# EAGLE design Anand1-TOP_New (EAGLE 9.5.2)
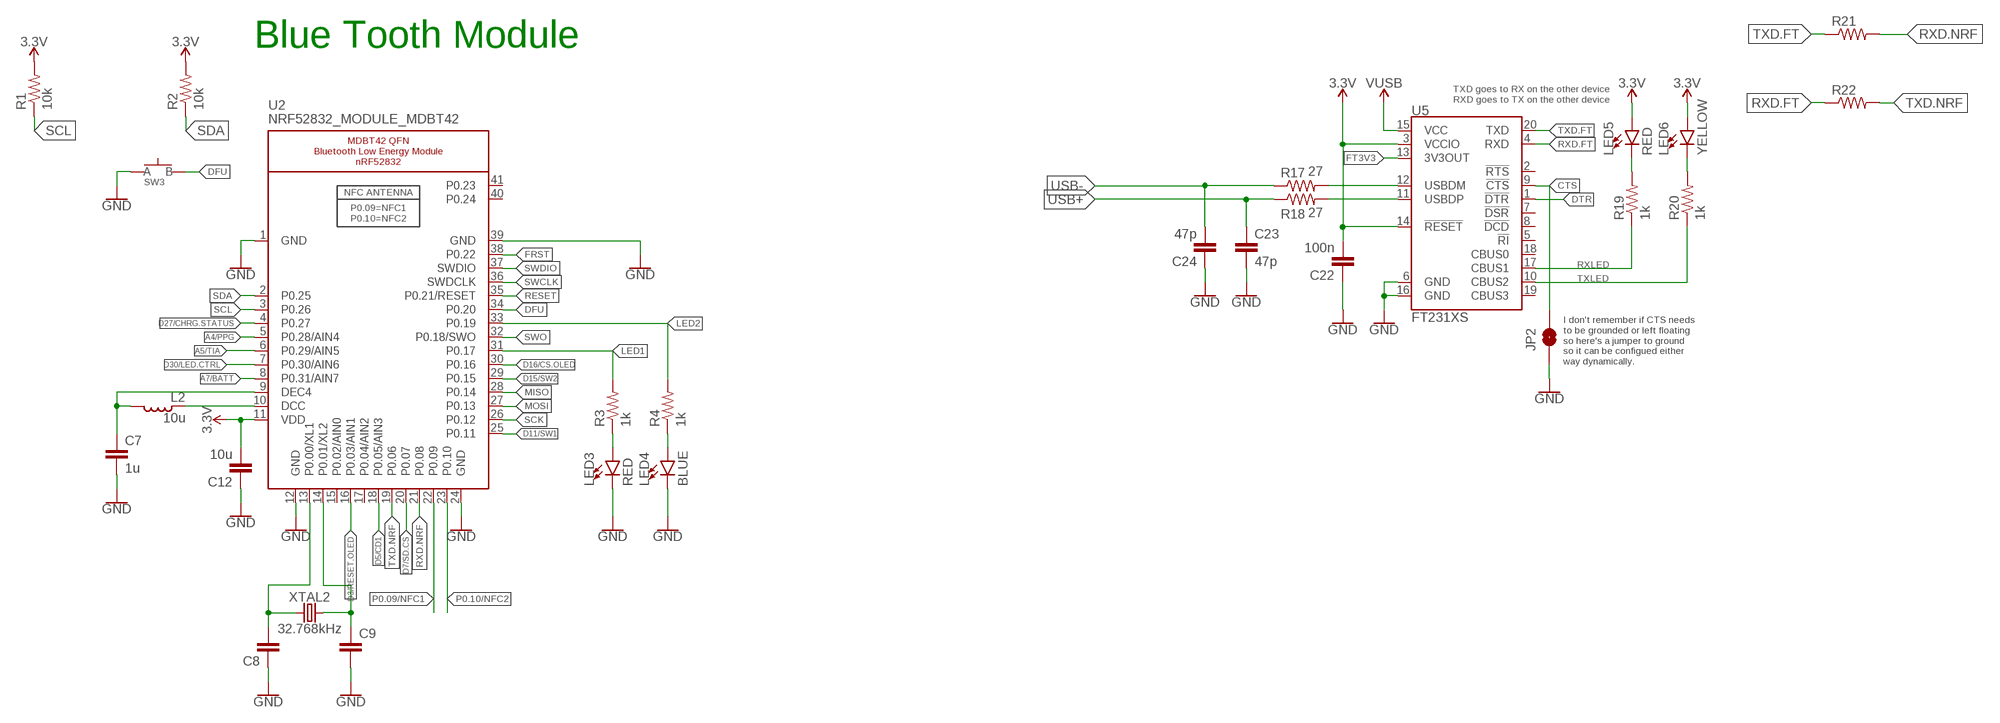
[diagram p0: schematic, sheet 1, part 1 of 3]
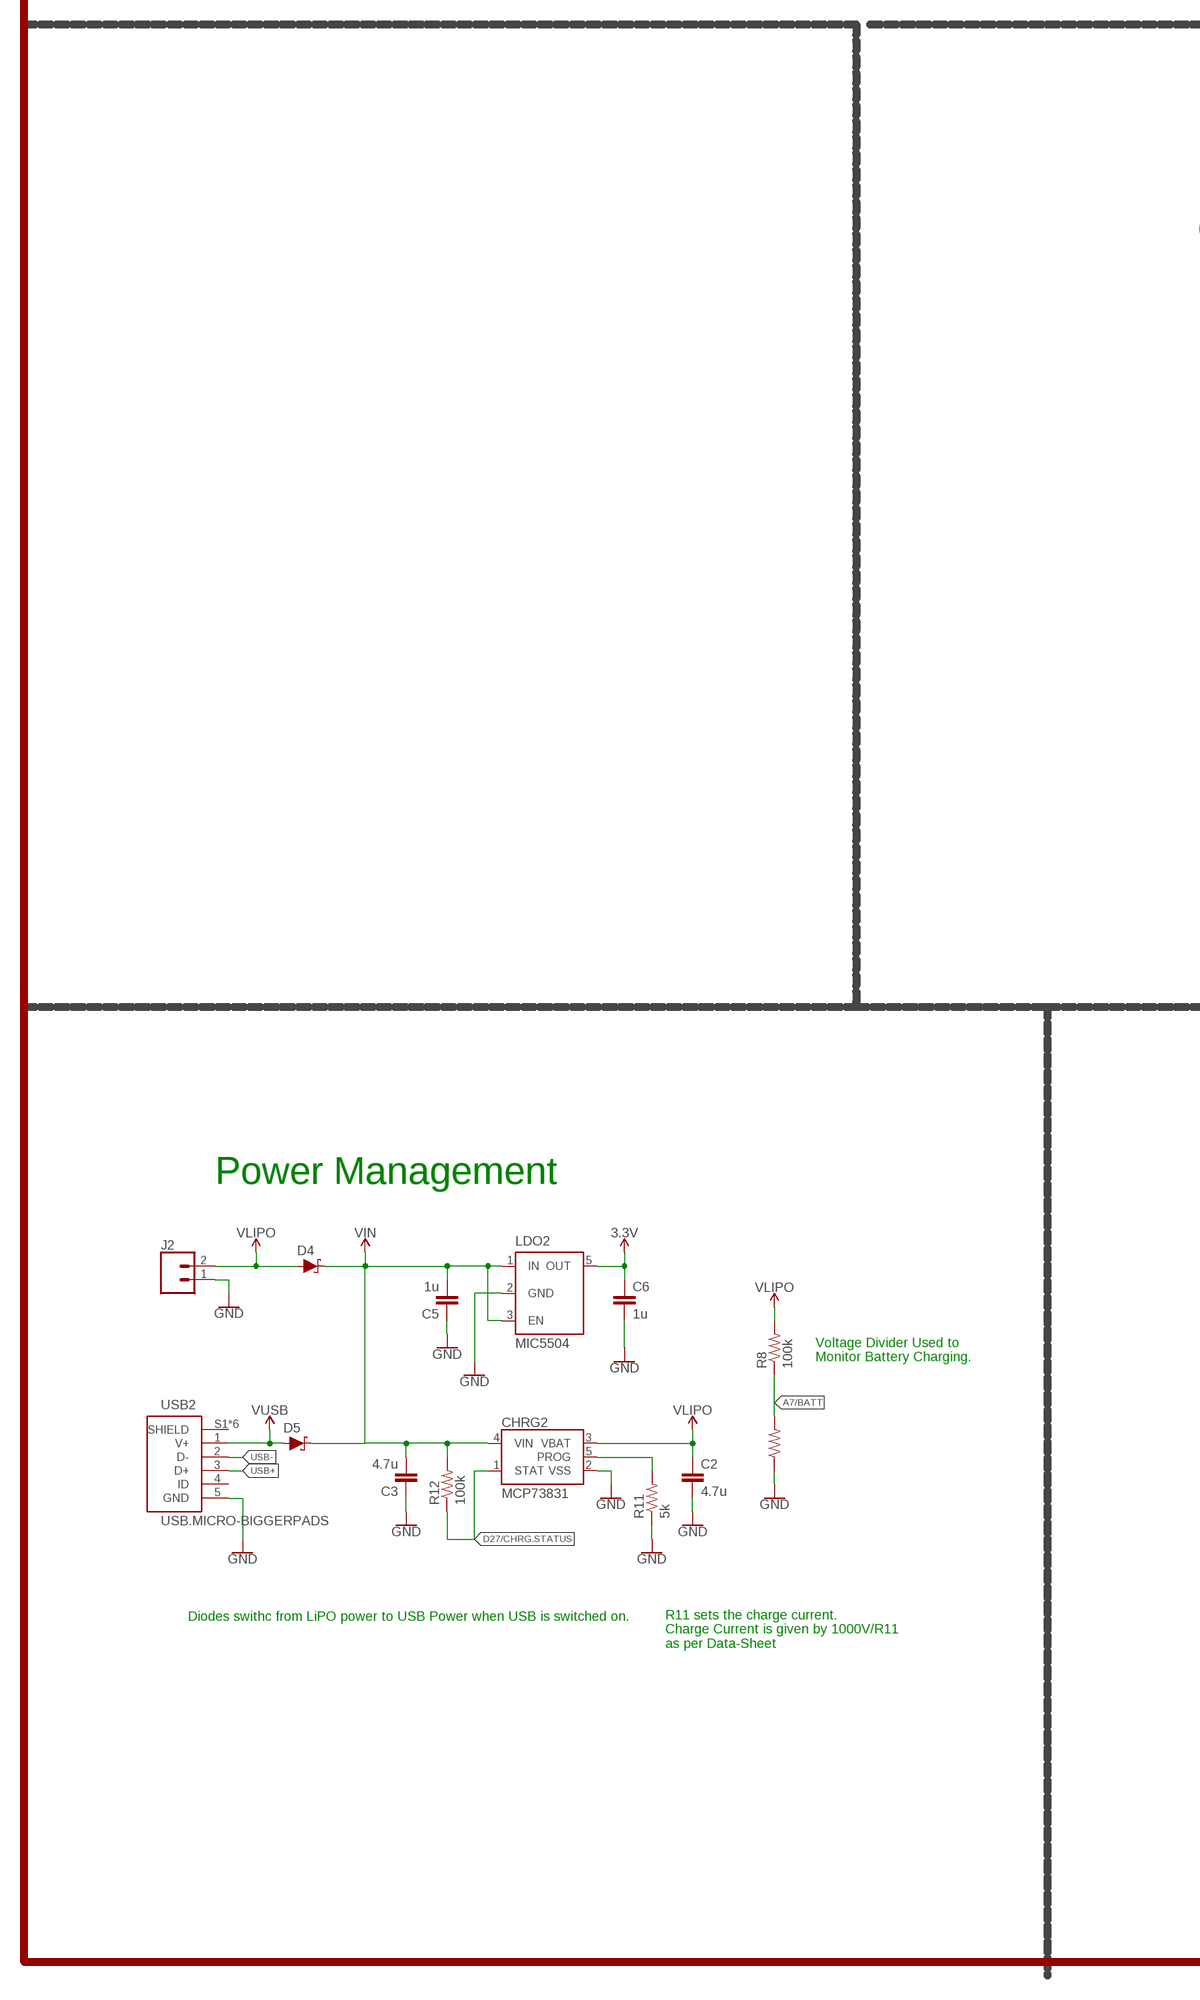
[diagram p1: schematic, sheet 1, part 2 of 3]
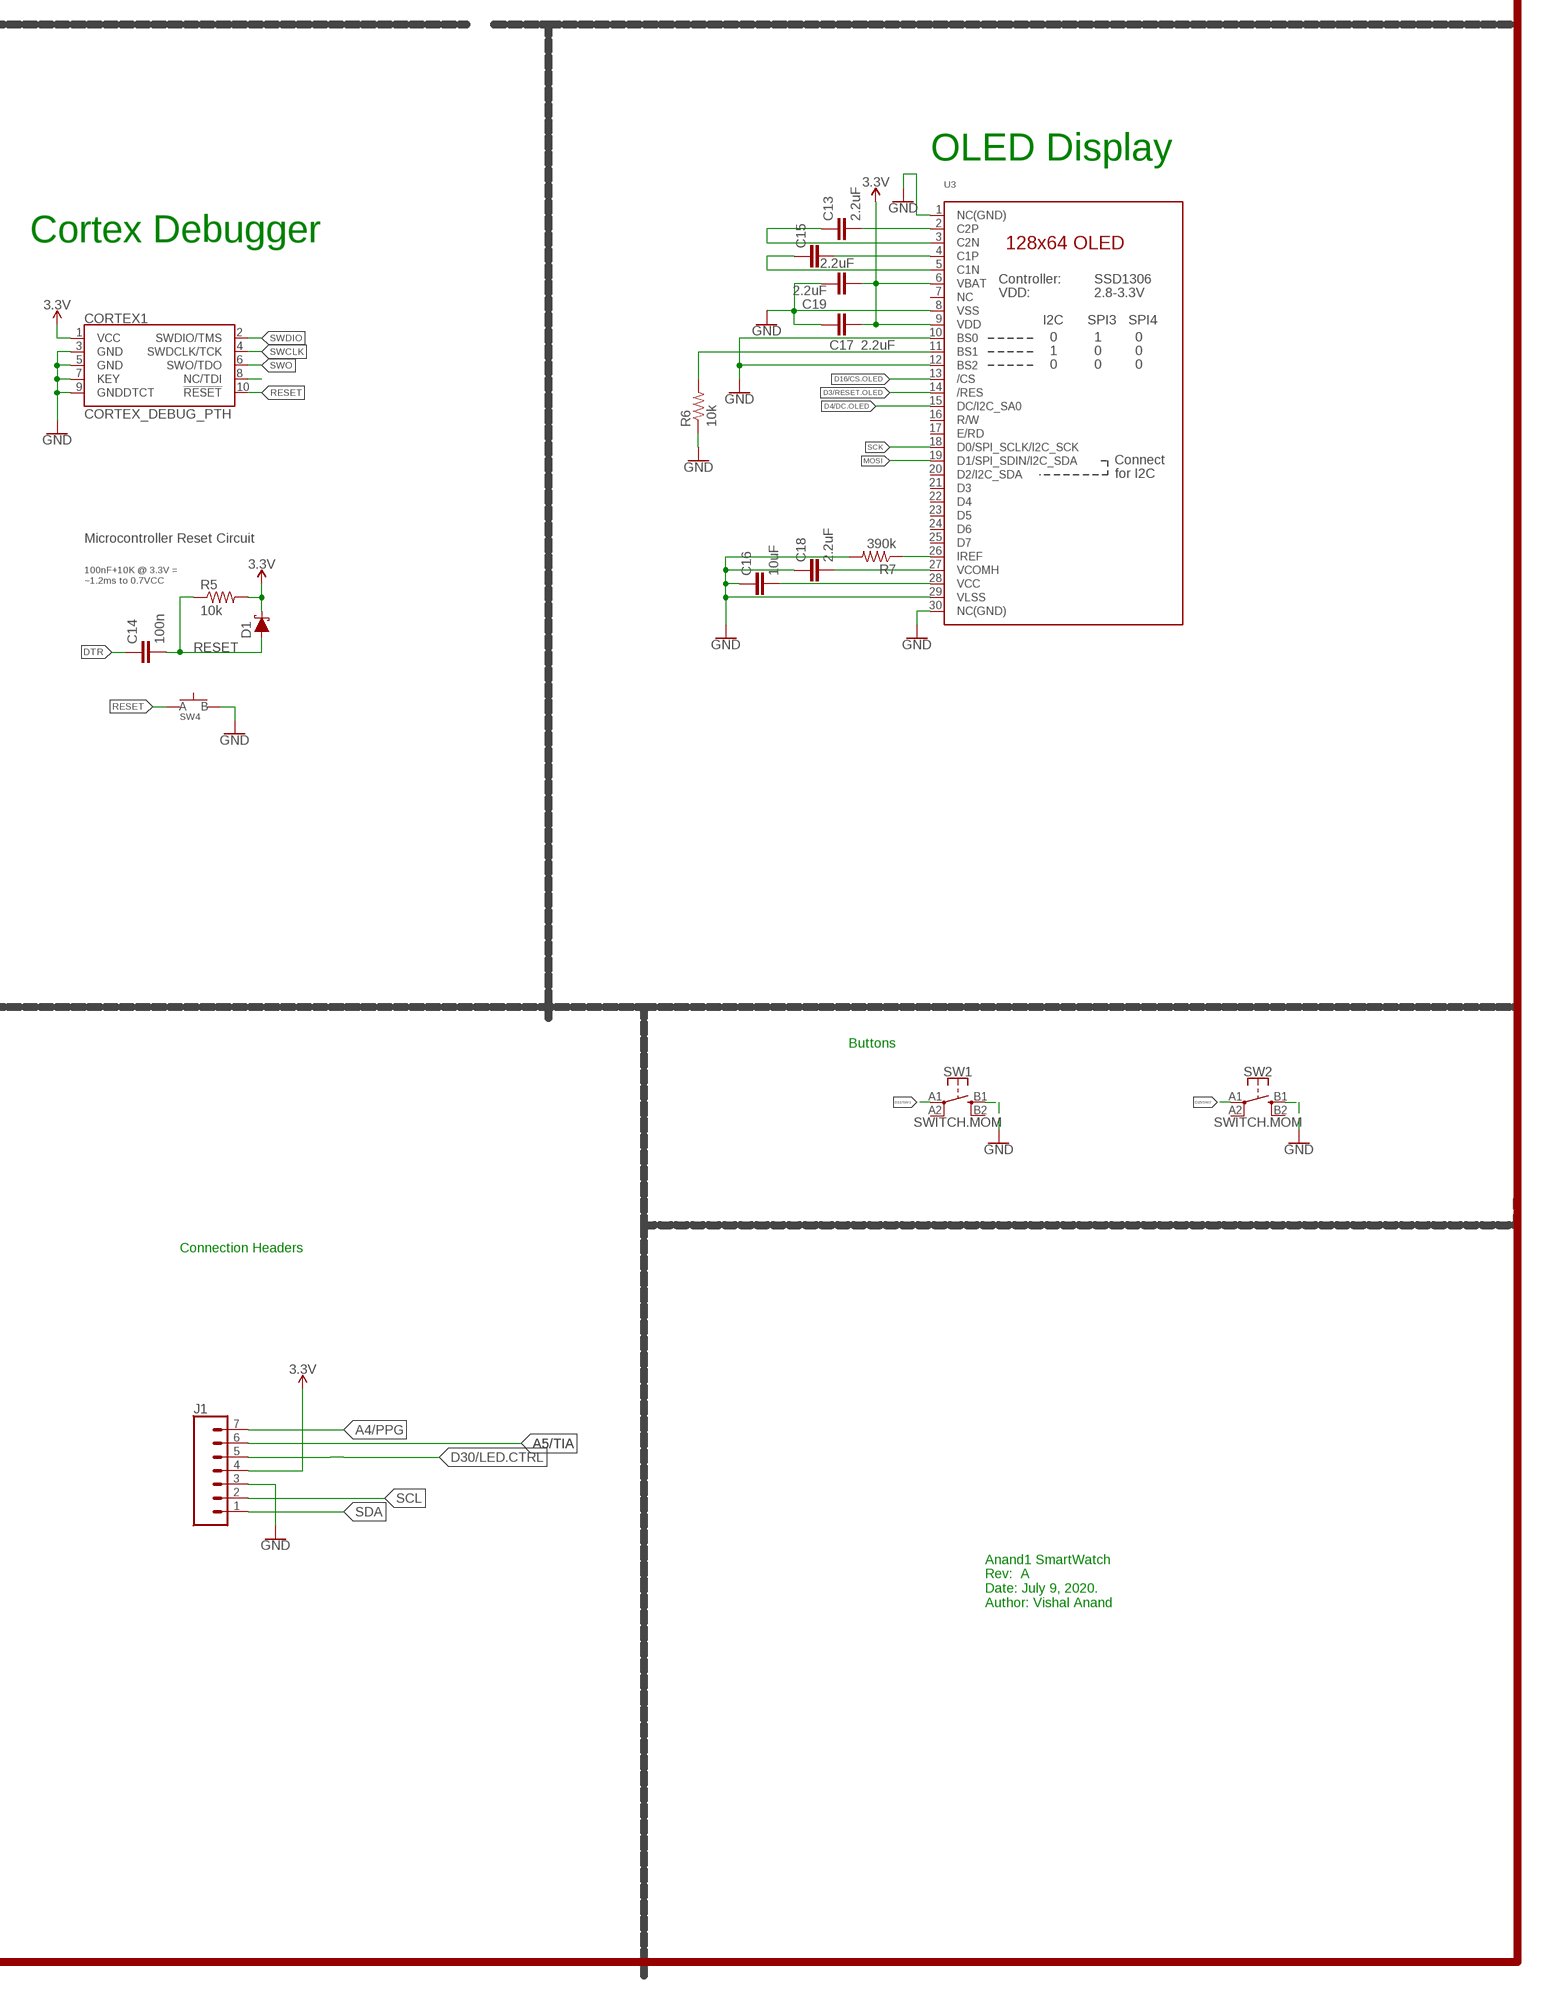
[diagram p2: schematic, sheet 1, part 3 of 3]

## Parts
C2  4.7u  CAPACITOR0603  [C0603]
C3  4.7u  CAPACITOR0603  [C0603]
C5  1u  CAPACITOR0603  [C0603]
C6  1u  CAPACITOR0603  [C0603]
C7  1u  CAPACITOR0603  [C0603]
C8  CAPACITOR0603  [C0603]
C9  CAPACITOR0603  [C0603]
C12  10u  CAPACITOR0805  [C0805]
C13  2.2uF  CAPACITOR0402  [C0402]
C14  100n  CAPACITOR0603  [C0603]
C15  2.2uF  CAPACITOR0402  [C0402]
C16  10uF  CAPACITOR0603  [C0603]
C17  2.2uF  CAPACITOR0402  [C0402]
C18  2.2uF  CAPACITOR0402  [C0402]
C19  2.2uF  CAPACITOR0402  [C0402]
C22  100n  CAPACITOR0603  [C0603]
C23  47p  CAPACITOR0603  [C0603]
C24  47p  CAPACITOR0603  [C0603]
CHRG2  MCP73831  [SOT23-5]
CORTEX1  CORTEX_DEBUG_PTH  [2X5-PTH-1.27MM]
D1  SCHOTTKY-USC  [USC]
D4  SCHOTTKY-USC  [USC]
D5  SCHOTTKY-USC  [USC]
J1  CONN_07-1.27MM  [1X07_1.27MM]
J2  CONN_02  [1X02]
JP2  JUMPER-SMT_2_NO_SILK  [SMT-JUMPER_2_NO_SILK]
L2  10u  INDUCTOR0603  [L0603]
LDO2  MIC5504  [SOT23-5]
LED3  RED  LED0603  [LED-0603]
LED4  BLUE  LED0603  [LED-0603]
LED5  RED  LED0603  [LED-0603]
LED6  YELLOW  LED0603  [LED-0603]
R1  10k  RESISTOR0603  [R0603]
R2  10k  RESISTOR0603  [R0603]
R3  1k  RESISTOR0603  [R0603]
R4  1k  RESISTOR0603  [R0603]
R5  10k  RESISTOR0603  [R0603]
R6  10k  RESISTOR0603  [R0603]
R7  390k  RESISTOR0603  [R0603]
R8  100k  RESISTOR0603  [R0603]
R9  100k  RESISTOR0603  [R0603]
R11  5k  RESISTOR0603  [R0603]
R12  100k  RESISTOR0603  [R0603]
R17  27  RESISTOR0603  [R0603]
R18  27  RESISTOR0603  [R0603]
R19  1k  RESISTOR0603  [R0603]
R20  1k  RESISTOR0603  [R0603]
R21  RESISTOR0603  [R0603]
R22  RESISTOR0603  [R0603]
SW1  SWITCH.MOM  [TACTILE_SWITCH_SMD_6.2MM_TALL]
SW2  SWITCH.MOM  [TACTILE_SWITCH_SMD_6.2MM_TALL]
SW3  SPST-PTS830GG140-COPY.1-3  [BUTTON-GULLWING]
SW4  SPST-PTS830GG140-COPY.1-3  [BUTTON-GULLWING]
U2  NRF52832_MODULE_MDBT42  [BLE_MODULE_RAYTAC_MDBT42]
U3  DISP_OLED_UG-2864HSWEG01-NO-WRAPAROUND  [UG-2864HSWEG01_0.96IN_NO-WRAPAROUND]
U5  FT231XS  [SSOP20_L]
USB2  USB.MICRO-BIGGERPADS  [USB-MICRO-01.BIGGERPADS]
XTAL2  32.768kHz  CRYSTALECS-.327-12.5-12-C-TR  [2-SMD.NOLEAD.2.0MMTO1.2MM]

## Nets
3.3V: C6.1 C12.2 C17.2 C19.2 C22.2 CORTEX1.1(VCC) D1.-(C) J1.4 LDO2.5(OUT) LED5.A LED6.A R1.2 R2.2 R5.2 U2.11(VDD) U3.6(VBAT) U3.9(VDD) U5.3(VCCIO) U5.14(!RESET)
A4/PPG: J1.7 U2.5(P0.28/AIN4)
A5/TIA: J1.6 U2.6(P0.29/AIN5)
A7/BATT: R8.1 R9.2 U2.8(P0.31/AIN7)
CTS: JP2.2 U5.9(!CTS)
D3/RESET.OLED: U2.16(P0.03/AIN1) U3.14(/RES)
D4/DC.OLED: U3.15(DC/I2C_SA0)
D5/CD1: U2.18(P0.05/AIN3)
D7/SD.CS: U2.20(P0.07)
D11/SW1: SW1.A1 U2.25(P0.11)
D15/SW2: SW2.A1 U2.29(P0.15)
D16/CS.OLED: U2.30(P0.16) U3.13(/CS)
D27/CHRG.STATUS: CHRG2.1(STAT) R12.1 U2.4(P0.27)
D30/LED.CTRL: J1.5 U2.7(P0.30/AIN6)
DFU: SW3.3(B) U2.34(P0.20)
DTR: C14.1 U5.1(!DTR)
FRST: U2.38(P0.22)
FT3V3: U5.13(3V3OUT)
GND: C2.2 C3.1 C5.1 C6.2 C7.2 C8.1 C9.2 C12.1 C16.1 C17.1 C18.1 C19.1 C22.1 C23.2 C24.1 CHRG2.2(VSS) CORTEX1.3(GND) CORTEX1.5(GND) CORTEX1.7(KEY) CORTEX1.9(GNDDTCT) J1.3 J2.1 JP2.1 LDO2.2(GND) LED3.C LED4.C R6.1 R7.2 R9.1 R11.1 SW1.B1 SW2.B1 SW3.1(A) SW4.3(B) U2.1(GND) U2.12(GND) U2.24(GND) U2.39(GND) U3.1(NC(GND)) U3.8(VSS) U3.10(BS0) U3.12(BS2) U3.29(VLSS) U3.30(NC(GND)) U5.6(GND) U5.16(GND) USB2.5(GND)
LED1: R3.2 U2.31(P0.17)
LED2: R4.2 U2.33(P0.19)
MISO: U2.28(P0.14)
MOSI: U2.27(P0.13) U3.19(D1/SPI_SDIN/I2C_SDA)
N$1: R6.2 U3.11(BS1)
N$2: R7.1 U3.26(IREF)
N$3: C13.2 U3.2(C2P)
N$4: C8.2 U2.13(P0.00/XL1) XTAL2.P$1
N$5: C13.1 U3.3(C2N)
N$6: C9.1 U2.14(P0.01/XL2) XTAL2.P$2
N$7: C15.2 U3.4(C1P)
N$8: C15.1 U3.5(C1N)
N$9: LED3.A R3.1
N$10: LED4.A R4.1
N$11: L2.1 U2.10(DCC)
N$12: C7.1 L2.2 U2.9(DEC4)
N$13: C16.2 U3.28(VCC)
N$14: CORTEX1.8(NC/TDI)
N$15: C18.2 U3.27(VCOMH)
N$16: CHRG2.5(PROG) R11.2
N$23: R17.2 U5.12(USBDM)
N$24: R18.2 U5.11(USBDP)
N$25: LED5.C R19.2
N$26: LED6.C R20.2
P0.09/NFC1: U2.22(P0.09)
P0.10/NFC2: U2.23(P0.10)
RESET: C14.2 CORTEX1.10(!RESET) D1.+(A) R5.1 SW4.1(A) U2.35(P0.21/RESET)
RXD.FT: R22.1 U5.4(RXD)
RXD.NRF: R21.2 U2.21(P0.08)
RXLED: R19.1 U5.17(CBUS1)
SCK: U2.26(P0.12) U3.18(D0/SPI_SCLK/I2C_SCK)
SCL: J1.2 R1.1 U2.3(P0.26)
SDA: J1.1 R2.1 U2.2(P0.25)
SWCLK: CORTEX1.4(SWDCLK/TCK) U2.36(SWDCLK)
SWDIO: CORTEX1.2(SWDIO/TMS) U2.37(SWDIO)
SWO: CORTEX1.6(SWO/TDO) U2.32(P0.18/SWO)
TXD.FT: R21.1 U5.20(TXD)
TXD.NRF: R22.2 U2.19(P0.06)
TXLED: R20.1 U5.10(CBUS2)
USB+: C23.1 R18.1 USB2.3(D+)
USB-: C24.2 R17.1 USB2.2(D-)
V_USB: D5.+(A) U5.15(VCC) USB2.1(V+) ; supply symbol labelled VUSB
VIN1: C3.2 C5.2 CHRG2.4(VIN) D4.-(C) D5.-(C) LDO2.1(IN) LDO2.3(EN) R12.2 ; supply symbol labelled VIN
VLIPO: C2.1 CHRG2.3(VBAT) D4.+(A) J2.2 R8.2
Unconnected: SW1.A2 SW1.B2 SW2.A2 SW2.B2 U2.15(P0.02/AIN0) U2.17(P0.04/AIN2) U2.40(P0.24) U2.41(P0.23) U3.7(NC) U3.16(R/W) U3.17(E/RD) U3.20(D2/I2C_SDA) U3.21(D3) U3.22(D4) U3.23(D5) U3.24(D6) U3.25(D7) U5.2(!RTS) U5.5(!RI) U5.7(!DSR) U5.8(!DCD) U5.18(CBUS0) U5.19(CBUS3) USB2.4(ID) USB2.S1(SHIELD) USB2.S2(SHIELD) USB2.S3(SHIELD) USB2.S4(SHIELD) USB2.S5(SHIELD) USB2.S6(SHIELD)

## Notes on the sheet
- Blue Tooth Module
- TXD goes to RX on the other device
  RXD goes to TX on the other device
- I don't remember if CTS needs
  to be grounded or left floating
  so here's a jumper to ground
  so it can be configued either
  way dynamically.
- OLED Display
- Cortex Debugger
- Microcontroller Reset Circuit
- 100nF+10K @ 3.3V =
  ~1.2ms to 0.7VCC
- Buttons
- Power Management
- Connection Headers
- Voltage Divider Used to 
  Monitor Battery Charging.
- Anand1 SmartWatch
  Rev:  A
  Date: July 9, 2020.
  Author: Vishal Anand
- Diodes swithc from LiPO power to USB Power when USB is switched on.
- R11 sets the charge current. 
  Charge Current is given by 1000V/R11
  as per Data-Sheet

## Library data of the parts
C2 C3 C5-C9 C12-C19 C22-C24 = LinnesLab-Passives:CAPACITOR
CHRG2 = LinnesLab-Power:MCP73831: MCP73831T Li-Ion, Li-Pol Controller Miniature single cell, fully integrated Li-Ion, Li-polymer charge management controller Datasheet <http://ww1.microchip.com/downloads/en/DeviceDoc/20001984g.pdf> SparkFun Products: SparkFun ESP32 Thing <https://www.sparkfun.com/products/13907> SparkFun 9DoF Razor IMU M0 <https://www.sparkfun.com/products/14001>; PROD_ID: IC-09995
CORTEX1 = LinnesLab-Connectors:CORTEX_DEBUG: Cortex Debug Connector - 10 pin Supports JTAG debug, Serial Wire debug, and Serial Wire Viewer. PTH and SMD connector options available. General Connector Information <http://infocenter.arm.com/help/topic/com.arm.doc.faqs/attached/13634/cortex_debug_connectors.pdf> Products: PTH Connector <http://www.digikey.com/product-detail/en/cnc-tech/3220-10-0100-00/1175-1627-ND/3883661> -via Digi-Key SparkFun PSoc <https://www.sparkfun.com/products/13229> SparkFun T <https://www.sparkfun.com/products/13810>
D1 D4 D5 = LinnesLab-DiscreteSemi:SCHOTTKY: Schottky diode A Schottky diode is a semiconductor diode which has a low forward voltage drop and a very fast switching action. Example: Digi-Key Part Number: RB161MM-20CT-ND
J1 = LinnesLab-Connectors:CONN_07: Multi connection point. Often used as Generic Header-pin footprint for 0.1 inch spaced/style header connections On any of the 0.1 inch spaced packages, you can populate with these: Break Away Headers - Straight <https://www.sparkfun.com/products/116> (PRT-00116) Break Away Male Headers - Right Angle <https://www.sparkfun.com/products/553> (PRT-00553) Female Headers <https://www.sparkfun.com/products/115> (PRT-00115) Break Away Headers - Machine Pin <https://www.sparkfun.com/products/117> (PRT-00117) Break Away Female Headers - Swiss Machine Pin <https://www.sparkfun.com/products/743> (PRT-00743) For SCREWTERMINALS and SPRING TERMINALS visit here: Screw Terimnals on SparkFun.com <https://www.sparkfun.com/search/results?term=Screw+Terminals> (5mm/3.5mm/2.54mm spacing) This device is also useful as a general connection point to wire up your design to another part of your project. Our various solder wires solder well into these plated through hole pads. Hook-Up Wire - Assortment (Stranded, 22 AWG) <https://www.sparkfun.com/products/11375> (PRT-11375) Hook-Up Wire - Assortment (Solid Core, 22 AWG) <https://www.sparkfun.com/products/11367> (PRT-11367) View the entire wire category on our website here <https://www.sparkfun.com/categories/141> Special notes: Molex polarized connector foot print use with SKU : PRT-08231 with associated crimp pins and housings. 1MM SMD Version SKU: PRT-10208 NOTES ON THE VARIANTS LOCK and LOCK_LONGPADS... This footprint was designed to help hold the alignment of a through-hole component (i.e. 6-pin header) while soldering it into place. You may notice that each hole has been shifted either up or down by 0.005 of an inch from it's more standard position (which is a perfectly straight line). This slight alteration caused the pins (the squares in the middle) to touch the edges of the holes. Because they are alternating, it causes a "brace" to hold the component in place. 0.005 has proven to be the perfect amount of "off-center" position when using our standard breakaway headers. Although looks a little odd when you look at the bare footprint, once you have a header in there, the alteration is very hard to notice. Also,if you push a header all the way into place, it is covered up entirely on the bottom side.
J2 = LinnesLab-Connectors:CONN_02: Multi connection point. Often used as Generic Header-pin footprint for 0.1 inch spaced/style header connections On any of the 0.1 inch spaced packages, you can populate with these: Break Away Headers - Straight <https://www.sparkfun.com/products/116> (PRT-00116) Break Away Male Headers - Right Angle <https://www.sparkfun.com/products/553> (PRT-00553) Female Headers <https://www.sparkfun.com/products/115> (PRT-00115) Break Away Headers - Machine Pin <https://www.sparkfun.com/products/117> (PRT-00117) Break Away Female Headers - Swiss Machine Pin <https://www.sparkfun.com/products/743> (PRT-00743) For SCREWTERMINALS and SPRING TERMINALS visit here: Screw Terimnals on SparkFun.com <https://www.sparkfun.com/search/results?term=Screw+Terminals> (5mm/3.5mm/2.54mm spacing) This device is also useful as a general connection point to wire up your design to another part of your project. Our various solder wires solder well into these plated through hole pads. Hook-Up Wire - Assortment (Stranded, 22 AWG) <https://www.sparkfun.com/products/11375> (PRT-11375) Hook-Up Wire - Assortment (Solid Core, 22 AWG) <https://www.sparkfun.com/products/11367> (PRT-11367) View the entire wire category on our website here <https://www.sparkfun.com/categories/141> Special notes: Molex polarized connector foot print use with: PRT-08233 with associated crimp pins and housings. 2.54_SCREWTERM for use with PRT-10571. 3.5mm Screw Terminal footprints for PRT-08084 5mm Screw Terminal footprints for use with PRT-08432
JP2 = LinnesLab-Switches:JUMPER-SMT_2_NO: Normally open jumper This jumper has two pads in close proximity to each other. Apply solder to close the connection. Round pads are easier to solder for beginners, but are a lot larger. SparkFun Product that uses the round pads: SparkFun EL Sequencer <https://www.sparkfun.com/products/12781>
L2 = LinnesLab-Passives:INDUCTOR
LDO2 = LinnesLab-Power:MIC5504: MIC5504 Voltage Regulator Output Voltages: 1.0V to 3.3V Input Voltages: 2.5V to 5.5V Link to Datasheet http://ww1.microchip.com/downloads/en/DeviceDoc/MIC550X.pdf
LED3-LED6 = LinnesLab-LED:LED: LED (Generic) Standard schematic elements and footprints for 5mm, 3mm, 1206, and 0603 sized LEDs. Generic LEDs with no color specified. LTST-C190KGKT: arrow indicates cathode
R1-R9 R11 R12 R17-R22 = LinnesLab-Passives:RESISTOR
SW1 SW2 = LinnesLab-Switches:SWITCH.MOM: PTS645SM43SMTR92 LFS
SW3 SW4 = LinnesLab-Switches:SPST-PTS830GG140-COPY
U2 = LinnesLab-Microcontrollers:NRF52832_MODULE_MDBT42: MDBT42 - BLE Module (nRF52832 QFN) VDD: 1.7-3.6V
U3 = LinnesLab-Displays:DISP_OLED_UG-2864HSWEG01: UG-2864HSWEG01 OLED display Both 1.3" and 0.96" models share the same FPC tab footprint, only the screen dimensions vary.
U5 = LinnesLab-DigitalIC:FT231X: FTDI FT231X Full Speed USB to Full-handshake UART This USB2.0 Full Speed IC offers a compact bridge to full handshake UART interfaces. The device is a UART, capable of operating up to 3MBaud, with low power consumption (8mA). The FT231X includes the complete FT-X series feature set and enables USB to be added into a system design quickly and easily over a UART interface. Datasheet <http://cdn.sparkfun.com/datasheets/Components/General%20IC/DS_FT231X.pdf>; DIGIKEY: 768-1156-5-ND; MFN: FT231XS-U
USB2 = LinnesLab-Connectors:USB.MICRO: DigiKey PN: 609-4613-1-ND
XTAL2 = LinnesLab-Clocks:CRYSTAL

## Board
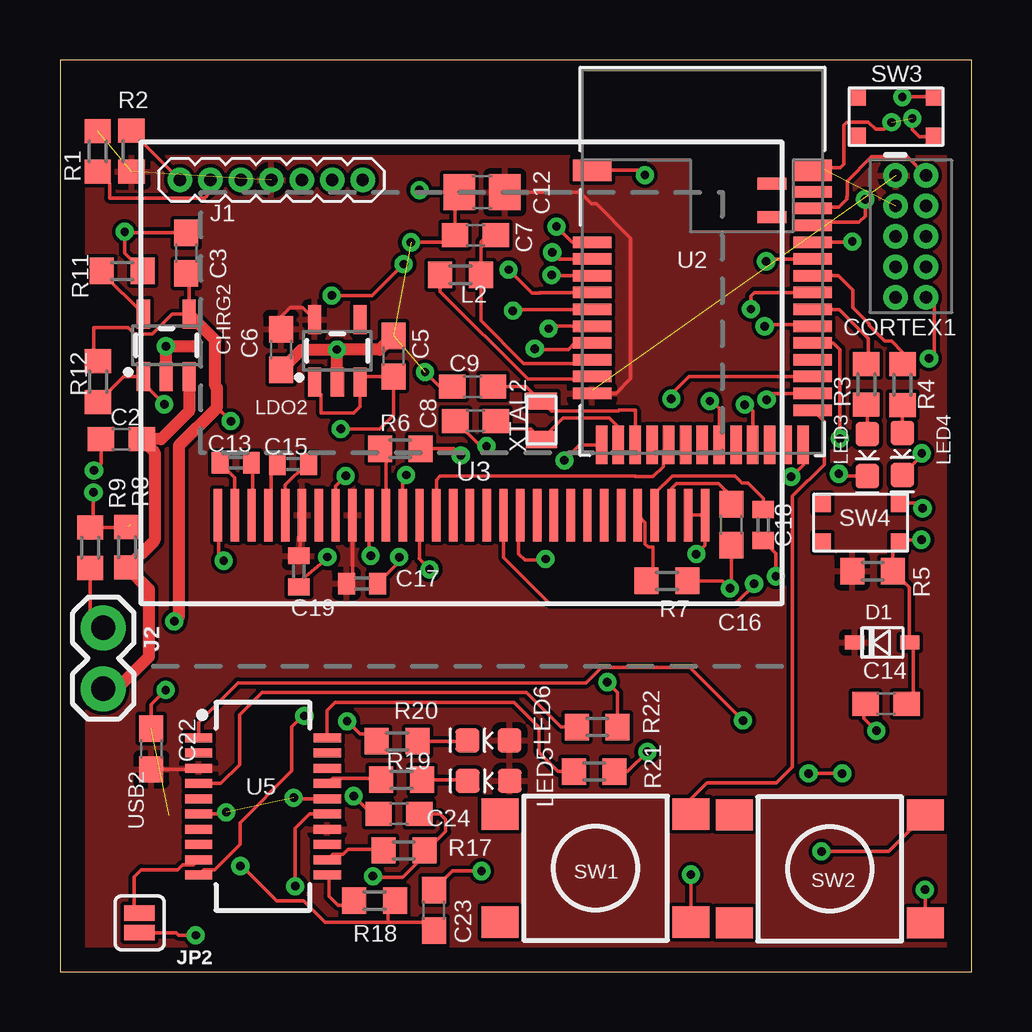
[diagram p3: board, top side]
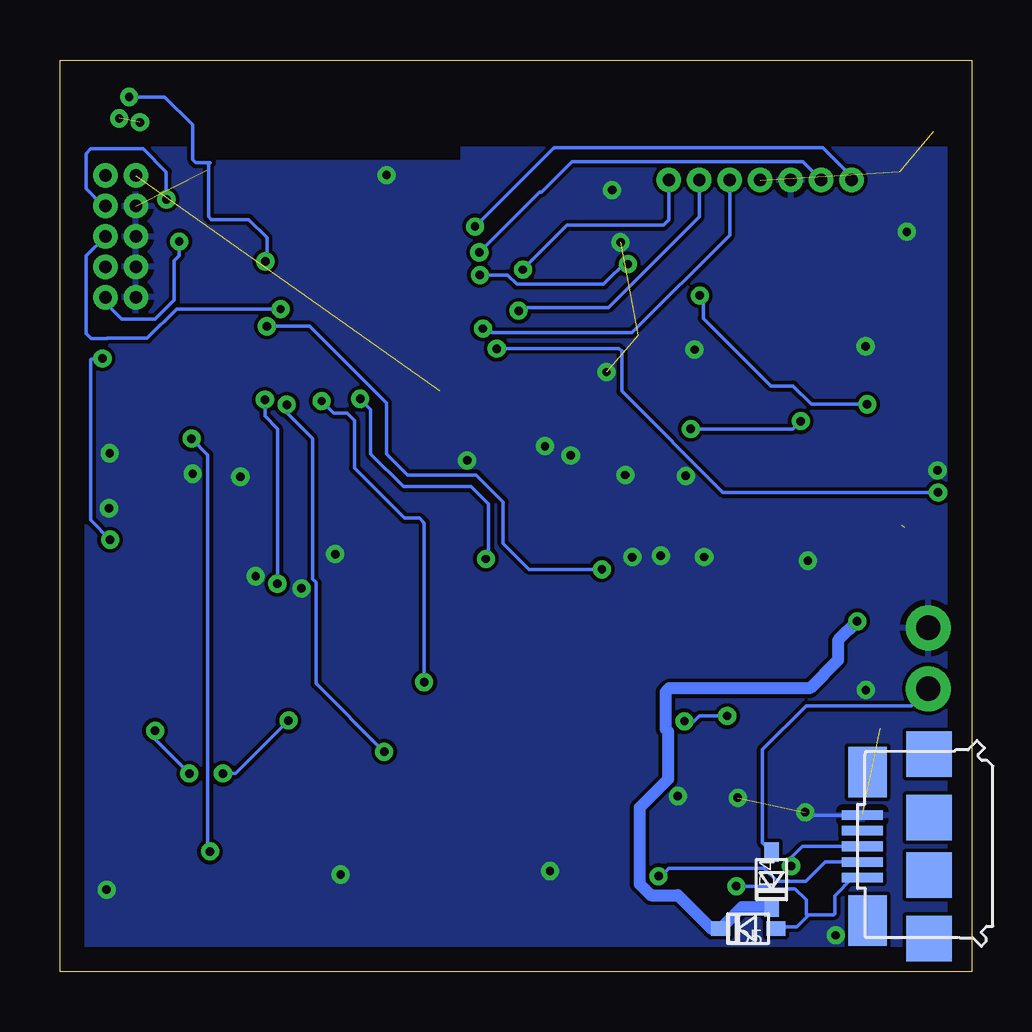
[diagram p4: board, bottom side, seen from below]

Size 38 x 38 mm. Coordinates in mm from the lower left corner, seen from the top.
Outline: 0,0 38,0 38,38 0,38 0,0
Copper layers (1*16): Top 0.035mm / dielectric 1.5mm / Bottom 0.035mm
Design rules "default": minimum track width 6mil, minimum drill 0.35mm, track to track 6mil, track to pad 6mil, pad to pad 6mil, via to via 6mil, smd to smd 6mil, copper to edge 40mil, drill to drill 6mil, minimum pad ring 10mil, minimum via ring 8mil, stop-mask expansion 4mil, vias tented up to drill 0mil, thermal gap 10mil

### Footprints (pad centres in the part's own frame; a part is rotated, then mirrored left to right if it is on the bottom)
C0603 = smd 1.1 x 1: 1 -0.85,0; 2 0.85,0
C0805 = smd 1.3 x 1.5: 1 -0.95,0; 2 0.95,0
C0402 = smd 0.7 x 0.9: 1 -0.65,0; 2 0.65,0
SOT23-5 = smd 0.55 x 1.2: 1 -0.95,-1.3; 2 0,-1.3; 3 0.95,-1.3; 4 0.95,1.3; 5 -0.95,1.3
2X5-PTH-1.27MM = drill 0.508 pad 1: 1 -2.54,-0.635; 2 -2.54,0.635; 3 -1.27,-0.635; 4 -1.27,0.635; 5 0,-0.635; 6 0,0.635; 7 1.27,-0.635; 8 1.27,0.635; 9 2.54,-0.635; 10 2.54,0.635
USC = smd 0.8 x 0.6: + -1.15,0; - 1.15,0
1X07_1.27MM = drill 0.508 pad 1: 1 0,0; 2 1.27,0; 3 2.54,0; 4 3.81,0; 5 5.08,0; 6 6.35,0; 7 7.62,0
1X02 = drill 1.016 pad 1.88: 1 0,0; 2 2.54,0
SMT-JUMPER_2_NO_SILK = smd 0.635 x 1.27: 1 -0.406,0; 2 0.406,0
L0603 = smd 1 x 1.1: 1 -0.85,0; 2 0.85,0
LED-0603 = smd 1 x 1: A -0.877,0; C 0.877,0
R0603 = smd 1 x 1.1: 1 -0.85,0; 2 0.85,0
TACTILE_SWITCH_SMD_6.2MM_TALL = smd 1.55 x 1.3: A1 -3.975,-2.25; A2 3.975,-2.25; B1 -3.975,2.25; B2 3.975,2.25
BUTTON-GULLWING = smd 0.7 x 0.75: 1 -1.6,0.825; 2 1.6,0.825; 3 -1.6,-0.825; 4 1.6,-0.825
BLE_MODULE_RAYTAC_MDBT42 = smd 1.6 x 0.9: 1 -4.6,3.8; 39 4.6,3.8 | smd 1.6 x 0.48: 2 -4.6,0.8; 3 -4.6,0.1; 4 -4.6,-0.6; 5 -4.6,-1.3; 6 -4.6,-2; 7 -4.6,-2.7; 8 -4.6,-3.4; 9 -4.6,-4.1; 10 -4.6,-4.8; 11 -4.6,-5.5; 25 4.6,-6.2; 26 4.6,-5.5; 27 4.6,-4.8; 28 4.6,-4.1; 29 4.6,-3.4; 30 4.6,-2.7; 31 4.6,-2; 32 4.6,-1.3; 33 4.6,-0.6; 34 4.6,0.1; 35 4.6,0.8; 36 4.6,1.5; 37 4.6,2.2; 38 4.6,2.9 | smd 0.48 x 1.6: 12 -4.2,-7.65; 13 -3.5,-7.65; 14 -2.8,-7.65; 15 -2.1,-7.65; 16 -1.4,-7.65; 17 -0.7,-7.65; 18 0,-7.65; 19 0.7,-7.65; 20 1.4,-7.65; 21 2.1,-7.65; 22 2.8,-7.65; 23 3.5,-7.65; 24 4.2,-7.65 | smd 1.2 x 0.5: 40 2.9,3.25; 41 2.9,1.85
UG-2864HSWEG01_0.96IN_NO-WRAPAROUND = smd 0.35 x 2.2: 1 -10.15,-1.2; 2 -9.45,-1.2; 3 -8.75,-1.2; 4 -8.05,-1.2; 5 -7.35,-1.2; 6 -6.65,-1.2; 7 -5.95,-1.2; 8 -5.25,-1.2; 9 -4.55,-1.2; 10 -3.85,-1.2; 11 -3.15,-1.2; 12 -2.45,-1.2; 13 -1.75,-1.2; 14 -1.05,-1.2; 15 -0.35,-1.2; 16 0.35,-1.2; 17 1.05,-1.2; 18 1.75,-1.2; 19 2.45,-1.2; 20 3.15,-1.2; 21 3.85,-1.2; 22 4.55,-1.2; 23 5.25,-1.2; 24 5.95,-1.2; 25 6.65,-1.2; 26 7.35,-1.2; 27 8.05,-1.2; 28 8.75,-1.2; 29 9.45,-1.2; 30 10.15,-1.2
SSOP20_L = smd 0.381 x 1.143: 1 -2.857,-2.68; 2 -2.223,-2.68; 3 -1.587,-2.68; 4 -0.953,-2.68; 5 -0.318,-2.68; 6 0.318,-2.68; 7 0.953,-2.68; 8 1.587,-2.68; 9 2.223,-2.68; 10 2.857,-2.68; 11 2.857,2.68; 12 2.223,2.68; 13 1.587,2.68; 14 0.953,2.68; 15 0.318,2.68; 16 -0.318,2.68; 17 -0.953,2.68; 18 -1.587,2.68; 19 -2.223,2.68; 20 -2.857,2.68
USB-MICRO-01.BIGGERPADS = smd 0.4 x 1.7: 1 -1.3,1.505; 2 -0.65,1.505; 3 0,1.505; 4 0.65,1.505; 5 1.3,1.505 | smd 1.9 x 1.9: S1 -3.85,-1.27; S2 -1.2,-1.27; S3 1.2,-1.27; S4 3.85,-1.27 | smd 2.1 x 1.6: S5 -3.1,1.28; S6 3.1,1.28
2-SMD.NOLEAD.2.0MMTO1.2MM = smd 0.7 x 1.3: P$1 -0.8,0; P$2 0.8,0

### Placement (x,y rotation side)
C2  2.56,22.19 180 top
C3  5.26,29.95 270 top
C5  13.9,25.65 270 top
C6  9.21,25.93 270 top
C7  17.32,30.7 180 top
C8  17.32,22.95 0 top
C9  17.2,24.38 180 top
C12  17.59,32.49 0 top
C13  7.33,21.21 180 top
C14  34.44,11.16 0 top
C15  9.71,21.16 180 top
C16  27.98,18.62 90 top
C17  12.59,16.17 180 top
C18  29.32,18.61 90 top
C19  9.96,16.68 90 top
C22  3.81,9.28 270 top
C23  15.59,2.55 90 top
C24  14.13,6.57 0 top
CHRG2  4.43,26.1 0 top
CORTEX1  35.47,30.65 270 top
D1  34.28,13.72 180 top
D4  8.33,3.83 270 bottom
D5  9.31,1.79 180 bottom
J1  5,33 0 top
J2  1.8,14.33 270 top
JP2  3.32,2.03 90 top
L2  16.7,29.04 0 top
LDO2  11.56,25.87 0 top
LED3  33.66,21.53 270 top
LED4  35.11,21.58 270 top
LED5  17.87,7.95 180 top
LED6  17.86,9.64 180 top
R1  1.57,34.19 90 top
R2  2.99,34.2 270 top
R3  33.61,24.48 90 top
R4  35.12,24.46 90 top
R5  33.87,16.69 180 top
R6  14.18,21.79 180 top
R7  25.31,16.29 0 top
R8  2.8,17.68 270 top
R9  1.26,17.67 90 top
R11  2.59,29.2 180 top
R12  1.59,24.6 90 top
R17  14.34,5.05 180 top
R18  13.11,2.96 180 top
R19  14.24,7.99 0 top
R20  14.05,9.6 0 top
R21  22.27,8.34 0 top
R22  22.4,10.19 0 top
SW1  22.32,4.31 180 top
SW2  32.09,4.28 180 top
SW3  34.85,35.64 180 top
SW4  33.38,18.71 180 top
U2  26.78,29.6 0 top
U3  16.74,20.22 0 top
U5  8.46,6.89 270 top
USB2  3.05,5.22 90 bottom
XTAL2  20.08,22.98 90 top

### Tracks (layer width: path | path; a pad name or v marks a point on that pad's centre or on a via)
3.3V  (3 unrouted)
  Top 0.152: U5.3 5.74,8.43 C22.2 | C19.2 10.09,18.98 U3.6 | C17.2 12.19,16.42 U3.9 | 22.18,24.21 U2.11 23.17,24.1 23.79,24.72 23.79,30.57 22.36,32 22.16,32 21.67,32.49 C12.2 19.03,32.49 | C6.1 9.21,27.3 9.59,27.67 10.11,27.67 LDO2.5
  pour Top: 0.47,33.97 37.38,33.97 37.81,33.55 37.81,0.15 37.89,0.07 0.41,0.07 -0.13,0.61 -0.13,33.9 -0.08,33.96 0.45,33.96
A4/PPG  (via drill 0.35)
  Top 0.152: U2.5 20.01,28.3 20.03,28.28 19.68,28.28 v18.7,29.26
  Bottom 0.152: J1.7 12.62,31.34 12.85,31.11 16.87,31.11 v18.71,29.27 v18.7,29.26
A5/TIA  (via drill 0.35)
  Top 0.152: U2.6 18.83,27.6 v18.88,27.55
  Bottom 0.152: v18.88,27.55 18.88,27.68 15.13,27.68 11.35,31.46 J1.6
A7/BATT  (via drill 0.35)  (1 unrouted)
  Top 0.152: U2.8 21.46,26.2 21.19,25.94 19.82,25.94 v19.79,25.96 | v1.39,19.97 1.39,18.65 R9.2 2.66,18.52 2.93,18.79 2.93,18.62
  Bottom 0.152: v19.79,25.96 19.79,25.98 14.7,25.98 14.58,25.85 14.58,24.19 10.36,19.97 v1.39,19.97 1.25,19.97
CTS
  Top 0.152: U5.9 5.65,4.53 5.57,4.45 5.12,4.45 4.91,4.25 3.39,4.25 3.09,3.94 3.09,2.67 JP2.2
D3/RESET.OLED
  Top 0.152: U3.14 15.69,20.5 15.84,20.65 23.98,20.65 24,20.63 24.72,20.63 25.15,21.06 25.15,21.72 U2.16
D11/SW1
  Top 0.152: U2.25 31.86,22.93 31.86,21.14 30.54,19.82 30.54,8.54 29.86,7.86 26.97,7.86 26.3,7.19 SW1.A1
D15/SW2  (via drill 0.35)
  Top 0.152: U2.29 32.24,26.2 32.51,25.93 v32.51,22.22 | SW2.A1 34.55,5.01 v31.74,5.01
  Bottom 0.152: v32.51,22.22 31.83,21.54 31.83,5.1 v31.74,5.01
D16/CS.OLED  (via drill 0.35)
  Top 0.152: U3.13 14.99,17.23 14.97,17.21 15.41,16.78 v15.41,16.76 | v29.38,26.9 29.38,26.96 31.32,26.96 U2.30
  Bottom 0.152: v15.41,16.76 18.44,16.76 19.52,17.85 19.52,19.57 20.65,20.7 23.5,20.7 24.39,21.58 24.39,23.7 27.59,26.9 v29.38,26.9
D27/CHRG.STATUS  (via drill 0.35)
  Top 0.152: R12.1 2.65,24.8 CHRG2.1 3.48,24.51 v4.35,23.65 | U2.4 20.53,29 v20.5,29.04 | v14.33,29.49 13.02,28.18 v11.33,28.18
  Bottom 0.152: v20.5,29.04 19.34,29.04 18.95,28.65 15.34,28.65 14.33,29.66 v14.33,29.49 | v11.33,28.18 11.18,28.04 11.18,27.23 8.37,24.41 7.44,24.41 6.68,23.65 v4.35,23.65
D30/LED.CTRL  (via drill 0.35)
  Top 0.152: U2.7 20.42,26.9 20.42,26.75 v20.37,26.8
  Bottom 0.152: v20.37,26.8 20.17,26.8 20,26.63 14.15,26.63 10.08,30.7 J1.5
DFU  (via drill 0.35)
  Top 0.152: U2.34 29.54,29.7 v29.44,29.61 | v35.11,36.46 v35.12,36.46 SW3.3
  Bottom 0.152: v29.44,29.61 29.37,29.67 29.37,30.6 30.13,31.35 31.7,31.35 31.81,31.46 31.81,33.64 31.74,33.71 32.34,33.71 32.47,33.84 32.47,35.29 33.63,36.46 v35.11,36.46
DTR  (via drill 0.35)
  Top 0.152: U5.1 5.78,10.39 7.42,12.04 21.93,12.04 22.57,12.67 26.26,12.67 v28.47,10.46 | v31.21,8.26 v32.61,8.26 | C14.1 33.51,11.08 33.51,10.56 v34.03,10.04
  Bottom 0.152: v28.47,10.46 30.68,8.26 v31.21,8.26 | v32.61,8.26 34.03,9.68 v34.03,10.04
GND  (via drill 0.35)  (6 unrouted)
  Top 0.152: v14.63,30.4 16.47,30.4 C7.2 16.47,32.31 C12.1 15.07,32.49 v14.98,32.58 | U3.30 26.89,19.27 | 11.49,18.64 U3.8 11.49,20.24 v11.91,20.66 | 1.81,14.32 J2.1 1.26,14.87 R9.1 | v11.15,17.28 11.15,17.23 9.96,16.24 C19.1 | v14.14,17.27 14.14,17.07 C17.1 | 22.29,33.3 U2.1 24.18,33.4 v24.38,33.2 | v16.71,21.52 16.43,21.79 R6.1 | 16.35,23.09 16.35,22.95 C8.1 17.52,21.9 v17.78,21.9 | SW3.1 35.82,34.81 35.53,35.1 v35.53,35.56 | U3.29 U3.30 | R7.2 27.62,16.29 v27.93,15.97 27.98,16.02 C16.1 | C18.1 29.84,17.43 v29.84,16.48 | U2.12 21.66,21.95 21.03,21.32 v21.03,21.31 | C22.1 3.81,11.14 v4.41,11.74 | C9.2 16.29,24.31 15.89,24.31 v15.22,24.99 | C23.2 16.37,4.19 v17.57,4.19 | SW1.B1 v26.3,4.04 | JP2.1 4.84,1.62 4.95,1.51 v5.66,1.51 | U3.10 12.89,17.39 v12.95,17.33 | U3.12 14.29,20.35 14.43,20.49 v14.43,20.7 | LED4.C 35.82,21.4 35.82,21.72 v35.93,21.61 | v35.93,21.61 | LED3.C 32.57,20.65 v32.47,20.75 | SW4.3 35.74,19.54 v35.96,19.31 | U3.1 6.61,19.01 6.61,17.34 v6.83,17.12 | 31.89,33.4 U2.39 31.49,33.52 32.53,33.52 32.67,33.66 32.67,35.28 32.8,35.41 33.69,35.41 34,35.1 34.37,35.1 v34.67,35.4 | C24.1 12.98,6.57 v12.24,7.31 | U3.30 26.89,17.77 v26.52,17.4 | U5.6 5.81,6.6 | SW2.B1 36.07,3.4 v36.06,3.41 | U2.24 30.98,21.12 v30.48,20.62 | 11.66,7.2 U5.16 9.78,7.2 v9.74,7.24 | U5.6 5.75,6.54 | U5.6 6.85,6.57 v6.92,6.64 v6.93,6.64 | C2.2 1.71,21.18 v1.42,20.89 | R11.1 2.7,29.95 v2.7,30.84 2.74,30.8 C3.1
  Top 0.508: 4.41,24.83 CHRG2.2 4.43,26.05 | 4.43,26.05 v4.42,26.06 | 5.72,26.05 4.43,26.05 | LDO2.2 11.55,24.59 v11.55,25.93 | C5.1 13.32,25.93 v11.55,25.93 | C6.2 10.06,25.93 v11.55,25.93
  Bottom 0.152: v14.63,30.4 14.62,30.4 | v4.41,11.74 4.41,11.7 | v6.93,6.64 6.81,6.52 USB2.5
  pour Bottom: 0.66,34.32 37.6,34.32 37.69,34.24 37.69,0.23 37.82,0.1 0.4,0.1 0.29,34.32 0.3,34.32 0.75,34.32
LED1
  Top 0.152: U2.31 32.49,27.6 33.7,26.39 33.7,25.42 R3.2
LED2
  Top 0.152: U2.33 32.45,29 33.05,28.4 33.05,27.67 33.73,26.99 33.73,26.94 34.39,26.28 34.67,26.28 35.12,25.83 R4.2
MOSI  (via drill 0.35)
  Top 0.152: U3.19 19.12,18.95 19.12,17.41 19.38,17.16 20.24,17.16 v20.24,17.2 | v25.48,23.88 25.48,24.06 26.22,24.8 U2.27
  Bottom 0.152: v25.48,23.88 25.04,23.43 25.04,21.58 23.69,20.23 20.87,20.23 20.13,19.49 20.13,17.31 v20.24,17.2
N$1
  Top 0.152: R6.2 13.33,21.65 13.59,21.39 U3.11
N$2
  Top 0.152: R7.1 24.71,16.55 24.71,17.7 24.52,17.7 24.39,17.83 24.39,18.73 U3.26
N$3
  Top 0.152: U3.2 7.29,20.59 C13.2
N$4
  Top 0.152: C8.2 18.51,22.62 19.63,22.62 XTAL2.P$1 20.96,23.07 22.9,23.07 23.28,22.69 U2.13
N$5
  Top 0.152: U3.3 8.03,19.06 8.03,21.16 C13.1
N$6
  Top 0.152: U2.14 23.98,23.4 23.3,23.4 23.27,23.37 22.07,23.37 20.48,23.37 XTAL2.P$2 20.05,23.76 19.43,24.38 C9.1
N$7
  Top 0.152: U3.4 8.81,19.14 8.81,20.9 C15.2
N$8
  Top 0.152: U3.5 9.39,20.28 10.27,21.16 C15.1
N$9
  Top 0.152: R3.1 33.66,23.58 LED3.A
N$10
  Top 0.152: R4.1 35.12,22.46 LED4.A
N$11
  Top 0.152: L2.1 15.85,28.35 19.5,24.69 22.07,24.69 U2.10
N$12
  Top 0.152: U2.9 22.02,25.35 19.32,25.35 17.55,27.13 L2.2 17.55,30.42 17.82,30.7 C7.1
N$13
  Top 0.152: U3.28 25.49,20.14 25.7,20.35 27.45,20.35 27.98,19.82 C16.2
N$15
  Top 0.152: U3.27 24.79,19.93 25.53,20.66 28.14,20.66 28.44,20.36 28.67,20.36 29.32,19.72 C18.2
N$16
  Top 0.152: R11.2 1.74,29.14 CHRG2.5
N$23
  Top 0.152: U5.12 11.36,4.88 11.81,4.88 12.01,5.08 13.46,5.08 R17.2
N$24
  Top 0.152: U5.11 11.22,3.95 11.22,3.14 11.59,2.77 12.07,2.77 R18.2
N$25
  Top 0.152: R19.2 16.95,7.99 LED5.C
N$26
  Top 0.152: LED6.C 16.94,9.6 R20.2
RESET  (via drill 0.35)
  Top 0.152: C14.2 35.57,11.44 35.57,13.58 D1.+ 35.4,13.74 35.4,16.01 R5.1 34.72,17.63 SW4.1 35.09,18 v35.91,18 | v33.03,30.43 33,30.4 U2.35 | v36.23,25.56 36.45,25.78 36.45,27.76 CORTEX1.10
  Bottom 0.152: v33.03,30.43 33.03,29.85 33.24,29.64 33.24,27.99 34.04,27.19 35.42,27.19 36.1,27.87 CORTEX1.10 | v35.91,18 36.73,18.81 36.73,25.5 36.69,25.54 36.25,25.54 v36.23,25.56
RXD.FT
  Top 0.152: R22.1 20.89,10.19 19.45,11.64 8.43,11.64 7.48,10.69 7.48,8.62 6.7,7.84 U5.4
RXD.NRF  (via drill 0.35)
  Top 0.152: U2.21 28.88,23.36 28.61,23.63 v28.55,23.63 | v24.48,9.16 23.66,8.34 R21.2
  Bottom 0.152: v28.55,23.63 28.55,23.3 27.47,22.22 27.47,16.37 27.33,16.23 27.33,12 v24.48,9.16
RXLED
  Top 0.152: U5.17 11.36,8.05 13.33,8.05 R19.1
SCK  (via drill 0.35)
  Top 0.152: U3.18 18.49,17.26 20.39,15.37 28.18,15.37 28.98,16.16 v28.94,16.16 | v29.46,23.84 29.72,24.1 U2.26
  Bottom 0.152: v28.94,16.16 28.94,16.66 28.93,16.66 28.93,22.62 29.46,23.15 v29.46,23.84
SCL  (via drill 0.35)
  Top 0.152: R1.1 2.07,32.84 2.07,32.24 6.03,32.24 6.27,32.48 J1.2 | U2.3 20.8,29.7 v20.52,29.98
  Bottom 0.152: v20.52,29.98 18.01,32.49 17.93,32.49 16.65,33.77 7.04,33.77 J1.2
SDA  (via drill 0.35)
  Top 0.152: J1.1 2.99,35.01 R2.1 | U2.2 21.35,30.4 v20.7,31.06
  Bottom 0.152: v20.7,31.06 17.41,34.35 6.2,34.35 5,33.15 J1.1
SWCLK  (via drill 0.35)
  Top 0.152: U2.36 31.52,31.24 33.31,31.24 33.56,31.49 v33.56,32.19
  Bottom 0.152: v33.56,32.19 33.56,33.33 34.54,34.3 36.71,34.3 36.91,34.1 36.91,32.63 36.19,31.91 CORTEX1.4
SWDIO
  Top 0.152: U2.37 31.44,31.86 32.46,31.86 32.8,32.2 32.8,32.31 32.82,32.32 32.82,32.95 33.83,33.97 35.32,33.97 CORTEX1.2
SWO  (via drill 0.35)
  Top 0.152: U2.32 28.94,28.3 28.8,28.16 v28.8,27.61
  Bottom 0.152: v28.8,27.61 33.15,27.61 34.36,26.4 36.02,26.4 36.04,26.38 36.69,26.38 36.91,26.59 36.91,29.84 CORTEX1.6
TXD.FT
  Top 0.152: R21.1 20.77,8.34 19.97,9.14 19.97,10.18 18.94,11.22 11.47,11.22 11.14,10.88 U5.20
TXD.NRF  (via drill 0.35)
  Top 0.152: U2.19 27.48,23.48 27.18,23.78 v27.09,23.78 | v22.82,12.06 23.25,11.63 R22.2
  Bottom 0.152: v27.09,23.78 26.6,23.28 26.04,23.28 25.73,22.97 25.73,20.99 23.63,18.9 23.02,18.9 22.82,18.7 v22.82,12.06
TXLED  (via drill 0.35)
  Top 0.152: U5.10 6,4.24 6.45,4.24 7.5,5.3 7.5,6.2 9.66,8.36 9.66,10.19 10.12,10.65 v10.19,10.65 | v11.97,10.43 12.51,9.9 12.9,9.9 R20.1
  Bottom 0.152: v10.19,10.65 11.35,10.65 11.58,10.43 v11.97,10.43
USB+  (via drill 0.35)
  Top 0.152: R18.1 13.67,2.67 13.67,2.06 | C23.1 15.24,2.04 13.67,2.04 13.67,2.06 | v7.52,4.4 7.55,4.43 9.03,2.95 10.16,2.95 11.05,2.06 13.67,2.06
  Bottom 0.152: v7.52,4.4 7.69,4.57 7.04,5.22 USB2.3
USB-  (via drill 0.35)
  Top 0.152: C24.2 15.84,6.57 16.08,6.33 16.08,5.84 15.66,5.42 15.56,5.42 R17.1 15.19,4.84 14.28,3.93 13.09,3.93 v13.05,3.97
  Bottom 0.152: v13.05,3.97 12.92,3.97 12.77,4.12 12.79,4.14 12.62,4.31 8.65,4.31 8.1,3.76 6.9,3.76 6.1,4.57 USB2.2
V_USB  (via drill 0.35)
  Top 0.152: v9.81,3.56 9.81,5.96 10.41,6.57 U5.15
  Bottom 0.152: USB2.1 4.94,3.92 5.7,3.16 5.7,2.41 5.74,2.37 6.79,2.37 | 6.79,2.37 6.89,2.37 6.89,2.98 7.36,3.46 8.23,3.46 8.33,3.56 v9.81,3.56 | 6.79,2.37 7.28,1.88 8.07,1.88 D5.+
VIN1  (via drill 0.35)
  Top 0.152: LDO2.1 10.56,24.53 10.56,24.38 10.89,24.05 10.89,23.28 12.24,23.28 12.51,23.55 LDO2.3 12.74,24.8 C5.2 13.9,23.2 13.31,22.62 v11.7,22.62 | C3.2 5.38,28.98 CHRG2.4 4.68,27.4 3.85,26.57 3.11,26.57 2.85,26.84 1.42,26.84 1.42,25.62 R12.2 | 7.24,22.82 v7.12,22.94 6.55,23.52
  Top 0.508: v4.76,14.6 4.95,14.79 4.95,21.92 6.55,23.52 6.55,24.33 6.47,24.41 6.47,26.32 CHRG2.4
  Bottom 0.152: v11.7,22.62 7.45,22.62 v7.12,22.94
  Bottom 0.508: D4.- 9.57,2.68 D5.- 10.85,1.79 12.24,3.19 13.37,3.19 13.83,3.65 13.83,6.83 12.65,8.02 12.65,10 12.76,10.11 12.76,11.65 12.6,11.8 6.75,11.8 5.57,12.98 5.57,13.79 v4.76,14.6
VLIPO
  Top 0.508: CHRG2.3 5.38,23.36 4.22,22.19 C2.1 3.94,21.66 3.94,17.97 R8.2 3.7,15.93 3.7,13.12 2.37,11.79 J2.2
  Bottom 0.152: J2.2 2.51,11.08 6.89,11.08 8.71,9.26 8.71,5.36 D4.+